# Altium project canbus_module.PrjPcb
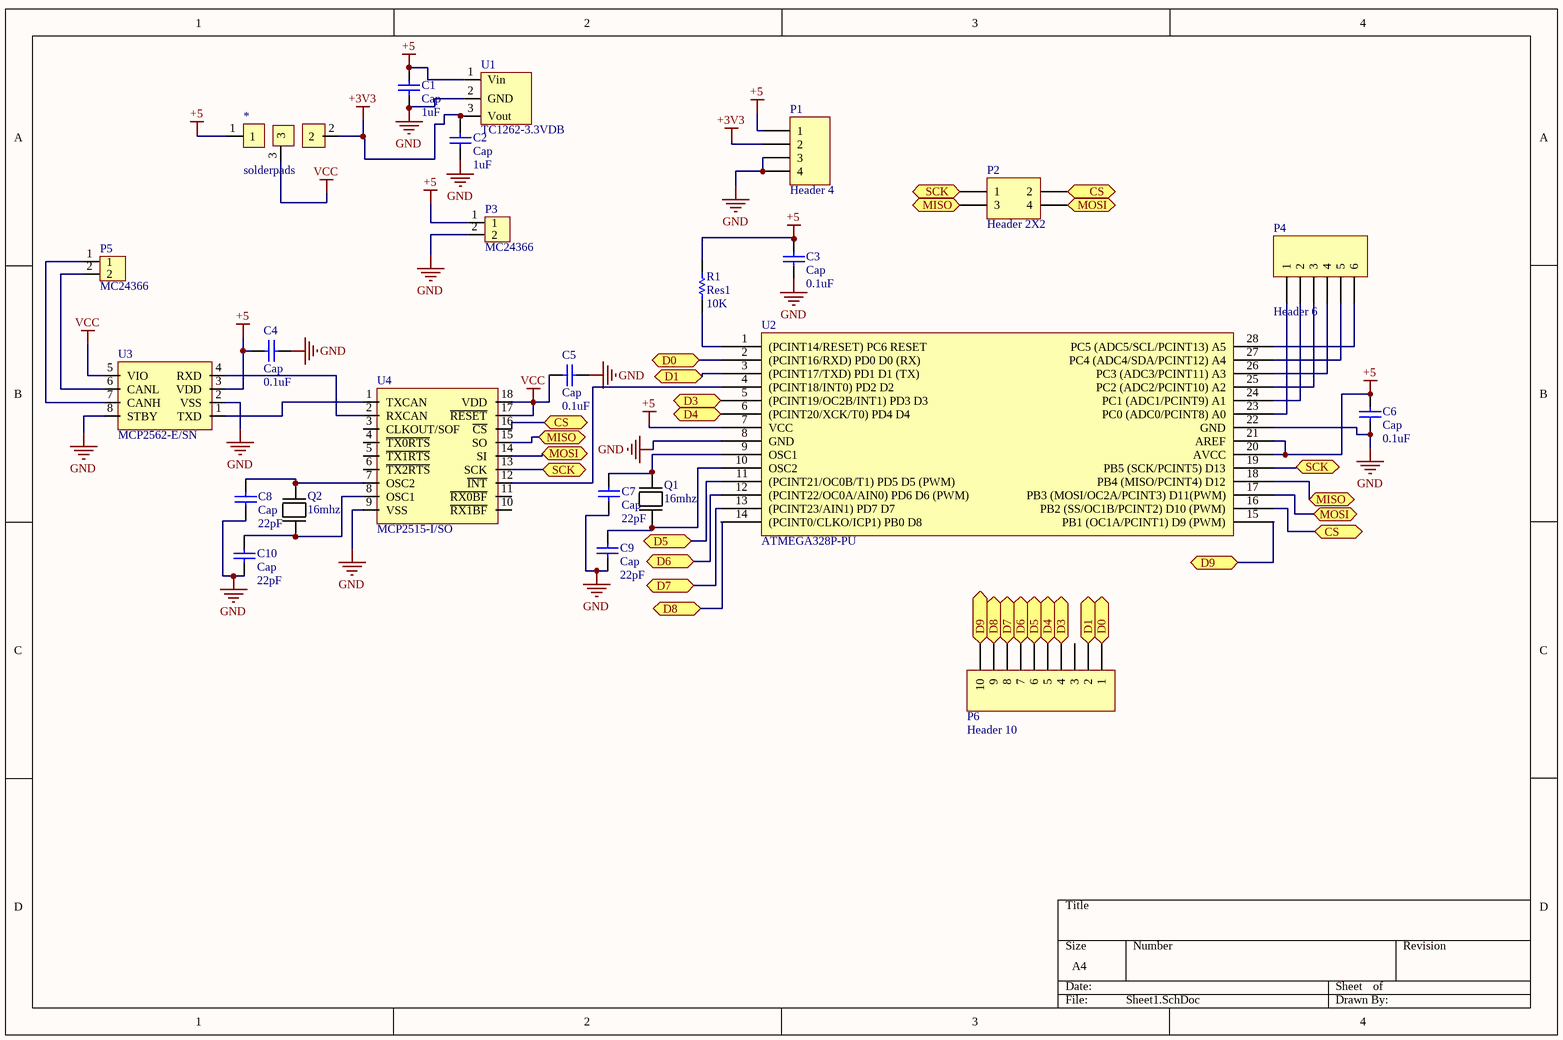
[diagram p0: Sheet1.SchDoc]
1 sheet, 24 parts. Net scope: flat (ports and power ports of the same name join across sheets).
Board file: PCB1.PcbDoc

## Sheet Sheet1.SchDoc
size A4

### Parts
*  solderpads  [solderpads]
C1  Cap  value 1uF  [0603 cap]
C2  Cap  value 1uF  [0603 cap]
C3  Cap  value 0.1uF  [0603 cap]
C4  Cap  value 0.1uF  [0603 cap]
C5  Cap  value 0.1uF  [0603 cap]
C6  Cap  value 0.1uF  [0603 cap]
C7  Cap  value 22pF  [0603 cap]
C8  Cap  value 22pF  [0603 cap]
C9  Cap  value 22pF  [0603 cap]
C10  Cap  value 22pF  [0603 cap]
P1  Header 4  [HDR1X4]
P2  Header 2X2  [HDR2X2]
P3  MC24366  [2pin screw terminal]
P4  Header 6  [HDR1X6]
P5  MC24366  [2pin screw terminal]
P6  Header 10  [HDR1X10]
Q1  16mhz  [DIP HC-49S]
Q2  16mhz  [DIP HC-49S]
R1  Res1  value 10K  [AXIAL-0.3]
U1  TC1262-3.3VDB  [SOT230P700X180-4N]
U2  ATMEGA328P-PU  [DIP28]
U3  MCP2562-E/SN  [SOIC8]
U4  MCP2515-I/SO  [SOIC18]

### Ports
CS, D0, D1, D3, D4, D5, D6, D7, D8, D9, MISO, MOSI, SCK

### Nets
+3V3: *.2 C2.2 P1.2 U1.3(Vout)
+5: *.1 C1.2 C3.2 C4.2 C6.2 P1.1 P3.1 R1.2 U1.1(Vin) U2.7(VCC) U2.20(AVCC) U2.21(AREF) U3.3(VDD)
GND: C1.1 C2.1 C3.1 C4.1 C5.1 C6.1 C7.1 C8.1 C9.1 C10.1 P1.3 P1.4 P3.2 U1.2(GND) U2.8(GND) U2.22(GND) U3.2(VSS) U3.8(STBY) U4.9(VSS)
VCC: *.3 C5.2 U3.5(VIO) U4.17(~{RESET}) U4.18(VDD)
NetC7_2: C7.2 Q1.2 U2.9(OSC1)
NetC8_2: C8.2 Q2.2 U4.7(OSC2)
NetC9_2: C9.2 Q1.1 U2.10(OSC2)
NetC10_2: C10.2 Q2.1 U4.8(OSC1)
NetP2_1: P2.1 U2.19(PB5_(SCK/PCINT5)_D13) U4.13(SCK) ; port SCK
NetP2_2: P2.2 U2.16(PB2_(SS/OC1B/PCINT2)_D10_(PWM)) U4.16(~{CS}) ; port CS
NetP2_3: P2.3 U2.18(PB4_(MISO/PCINT4)_D12) U4.15(SO) ; port MISO
NetP2_4: P2.4 U2.17(PB3_(MOSI/OC2A/PCINT3)_D11(PWM)) U4.14(SI) ; port MOSI
NetP4_1: P4.1 U2.23(PC0_(ADC0/PCINT8)_A0)
NetP4_2: P4.2 U2.24(PC1_(ADC1/PCINT9)_A1)
NetP4_3: P4.3 U2.25(PC2_(ADC2/PCINT10)_A2)
NetP4_4: P4.4 U2.26(PC3_(ADC3/PCINT11)_A3)
NetP4_5: P4.5 U2.27(PC4_(ADC4/SDA/PCINT12)_A4)
NetP4_6: P4.6 U2.28(PC5_(ADC5/SCL/PCINT13)_A5)
NetP5_1: P5.1 U3.7(CANH)
NetP5_2: P5.2 U3.6(CANL)
NetP6_1: P6.1 U2.2((PCINT16/RXD)_PD0_D0_(RX)) ; port D0
NetP6_2: P6.2 U2.3((PCINT17/TXD)_PD1_D1_(TX)) ; port D1
NetP6_4: P6.4 U2.5((PCINT19/OC2B/INT1)_PD3_D3) ; port D3
NetP6_5: P6.5 U2.6((PCINT20/XCK/T0)_PD4_D4) ; port D4
NetP6_6: P6.6 U2.11((PCINT21/OC0B/T1)_PD5_D5_(PWM)) ; port D5
NetP6_7: P6.7 U2.12((PCINT22/OC0A/AIN0)_PD6_D6_(PWM)) ; port D6
NetP6_8: P6.8 U2.13((PCINT23/AIN1)_PD7_D7) ; port D7
NetP6_9: P6.9 U2.14((PCINT0/CLKO/ICP1)_PB0_D8) ; port D8
NetP6_10: P6.10 U2.15(PB1_(OC1A/PCINT1)_D9_(PWM)) ; port D9
NetR1_1: R1.1 U2.1((PCINT14/RESET)_PC6_RESET)
NetU2_4: U2.4((PCINT18/INT0)_PD2_D2) U4.12(~{INT})
NetU3_1: U3.1(TXD) U4.1(TXCAN)
NetU3_4: U3.4(RXD) U4.2(RXCAN)

Not connected (* = marked no-connect by the designer): P6 3; U4 3(CLKOUT/SOF) 4(~{TX0RTS}) 5(~{TX1RTS}) 6(~{TX2RTS}) 10(~{RX1BF}) 11(~{RX0BF})

### Library data of the parts
C1-C10 = Cap: Capacitor; Manufacturer: Walsin Technologies; Manufacturer Part Number: 0603B104K500CT; Capacitance: 100000 pF; Case Style: Ceramic Chip; Product Depth (mm): 0.8 mm; Product Diameter (mm): Not Required mm; Product Length (mm): 1.6 mm; Rad Hardened: No; Temp Coeff (Dielectric): X7R; Tolerance (+ or -): 10%; Voltage: 50VDC; Wire Form: Not Required; Published: 8-Jun-2000; LatestRevisionDate: 17-Jul-2002; LatestRevisionNote: Re-released for DXP Platform.; PackageReference: RAD-0.3; Publisher: Altium Limited; PackageDescription: Radial Cap, Thru-Hole; 2 Leads; 0.3 in Pin Spacing; Supplier 1: Farnell; Stock 1: 3233000; Pricing 1: 4000=0.0042, 20000=0.0028, 40000=0.0022 (EUR); Construction: SMT Chip; Failure Rate: Not Required; Mounting Style: Surface Mount; Operating Temp Range: -55C to 125C; Package / Case: 0603; Packaging: Tape and Reel; Product Height (mm): 0.8 mm; ComponentLink1URL: https://www.verical.com/server-webapp/html/getDatasheet?partID=415741; ComponentLink1Description: https://www.verical.com/server-webapp/html/getDatasheet?partID=415741; ComponentLink2URL: http://www.farnell.com/datasheets/1958513.pdf; ComponentLink2Description: http://www.farnell.com/datasheets/1958513.pdf; ComponentLink3URL: http://components.arrow.com/part/dataview/0323_00656447; ComponentLink3Description: http://components.arrow.com/part/dataview/0323_00656447; Supplier Part Number 1: 2495333
P1 = Header 4: Header, 4-Pin; LatestRevisionDate: 17-Jul-2002; LatestRevisionNote: Re-released for DXP Platform.; Publisher: Altium Limited
P2 = Header 2X2: Header, 2-Pin, Dual row; LatestRevisionDate: 17-Jul-2002; LatestRevisionNote: Re-released for DXP Platform.; Publisher: Altium Limited
P3 P5 = MC24366: TERMINAL BLOCK EUROSTYLE, 2POS, 26-12AWG; Manufacturer: Multicomp; No. of Positions: 2Ways; Rated Voltage: 300V; Rated Current: 16A; Wire Size AWG Min: 26AWG; Wire Size AWG Max: 12AWG; Pitch Spacing: 5.08mm; Wire Connection Method: Screw; Block Orientation: Through Hole Right Angle; SVHC: No SVHC (15-Jun-2015); Supplier 1: Farnell; Manufacturer Part Number: MC24366; Stock 1: 9112; Pricing 1: 1=0.319, 5=0.288, 25=0.257, 50=0.226, 100=0.195, 250=0.165 (EUR); Series: MB310-508M; ComponentLink1URL: https://datasheet.ciiva.com/23597/ta-987-23597041.pdf; ComponentLink1Description: https://datasheet.ciiva.com/23597/ta-987-23597041.pdf; ComponentLink2URL: https://datasheet.ciiva.com/5717/ta-987-5717047.pdf; ComponentLink2Description: https://datasheet.ciiva.com/5717/ta-987-5717047.pdf; Supplier Part Number 1: 2396251
P4 = Header 6: Header, 6-Pin; LatestRevisionDate: 17-Jul-2002; LatestRevisionNote: Re-released for DXP Platform.; Publisher: Altium Limited
P6 = Header 10: Header, 10-Pin; LatestRevisionDate: 17-Jul-2002; LatestRevisionNote: Re-released for DXP Platform.; Publisher: Altium Limited
Q1 Q2 = 9B-16.000MAAJ-B: 16MHz ±30ppm Crystal 18pF 30 Ohm -20°C ~ 70°C  Through Hole HC49/US; Manufacturer: TXC; Catalog Drawings: 9B Series Side 1 / 9B Series Side 2 / 9B Series Bottom / 9B Series Top; Type: MHz Crystal; ESR (Equivalent Series Resistance): 30 Ohm; Operating Mode: Fundamental; Dynamic Catalog: 9B Series; Other Names: 887-1019; Supplier 1: Farnell; Manufacturer Part Number: 9B-16.000MAAJ-B; Stock 1: 9009; Pricing 1: 1=0.436, 50=0.303, 100=0.252, 250=0.248, 500=0.235, 1000=0.186, 5000=0.179, 10000=0.175 (EUR); Standard Package: 1,000; Category: Crystals and Oscillators; Family: Crystals; Series: 9B; Frequency: 16MHz; Frequency Stability: ±30ppm; Frequency Tolerance: ±30ppm; Load Capacitance: 18pF; Operating Temperature: -20°C ~ 70°C; Mounting Type: Through Hole; Package / Case: HC49/US; Size / Dimension: 0.453" L x 0.197" W (11.50mm x 5.00mm); Height: 0.145" (3.68mm); Packaging: Bulk; ComponentLink1URL: https://datasheet.ciiva.com/855/9b-855214.pdf; ComponentLink1Description: https://datasheet.ciiva.com/855/9b-855214.pdf; ComponentLink2URL: https://datasheet.ciiva.com/1356/number-crystal-basic-1356749.pdf; ComponentLink2Description: https://datasheet.ciiva.com/1356/number-crystal-basic-1356749.pdf; ComponentLink3URL: https://datasheet.ciiva.com/26833/getdatasheetpartid-743113-26833255.pdf; ComponentLink3Description: https://datasheet.ciiva.com/26833/getdatasheetpartid-743113-26833255.pdf; Supplier Part Number 1: 1842216
R1 = Res1: Resistor; Published: 8-Jun-2000; LatestRevisionDate: 17-Jul-2002; LatestRevisionNote: Re-released for DXP Platform.; PackageReference: AXIAL-0.3; Publisher: Altium Limited; PackageDescription: Axial Device, Thru-Hole; 2 Leads; 0.3 in Pin Spacing
U2 = ATMEGA328P-PU: ATMEL         ATMEGA328P-PU            8 Bit Microcontroller, Low Power High Performance, ATmega, 20 MHz, 32 KB, 2 KB, 28 Pins, DIP; Manuf. Code: ATM; Clock speed: 20 MHz; Series (embedded microcontroller): AVR® ATmega; Core size: 8-Bit; Processor core: AVR; Oscillator type: Internal; Peripherals: Brown-out Detect/Reset, POR, PWM, WDT; I/O number: 23; Program memory type: FLASH; Supply voltage (max.): 5.5 V; Supply voltage (min.): 1.8 V; Data converter (embedded microcontroller): A/D 6x10b; EEPROM size: 1 K x 8; Connectivity: I²C, SPI, UART/USART; Program memory size: 32 KB (16 K x 16); RAM size: 2 K x 8; Casing: PDIP 28; Supplier 1: Farnell; Manufacturer: Atmel; Manufacturer Part Number: ATMEGA328P-PU; Stock 1: 2066; Pricing 1: 1=3.33, 10=2.98, 25=2.68, 50=2.48, 100=2.35, 250=1.98, 600=1.67, 2000=1.64 (EUR); Type: ATMEGA328P-PU; Max. operating temperature: +85 °C; Operating temperature (min.): -40 °C; ComponentLink1URL: https://datasheet.ciiva.com/19457/2139111-19457070.pdf; ComponentLink1Description: https://datasheet.ciiva.com/19457/2139111-19457070.pdf; ComponentLink2URL: https://datasheet.ciiva.com/20168/73-4283-20168380.pdf; ComponentLink2Description: https://datasheet.ciiva.com/20168/73-4283-20168380.pdf; ComponentLink3URL: https://datasheet.ciiva.com/1157/1684409-1157696.pdf; ComponentLink3Description: https://datasheet.ciiva.com/1157/1684409-1157696.pdf; ComponentLink4URL: https://datasheet.ciiva.com/29119/155197-da-01-en-microcontr-atmega328p-pu-8bit-pdip-28-29119593.pdf; ComponentLink4Description: https://datasheet.ciiva.com/29119/155197-da-01-en-microcontr-atmega328p-pu-8bit-pdip-28-29119593.pdf; ComponentLink5URL: https://datasheet.ciiva.com/26818/atmega328p-pu-26818578.pdf; ComponentLink5Description: https://datasheet.ciiva.com/26818/atmega328p-pu-26818578.pdf; ComponentLink6URL: https://datasheet.ciiva.com/15213/getdatasheetpartid-318533-15213133.pdf; ComponentLink6Description: https://datasheet.ciiva.com/15213/getdatasheetpartid-318533-15213133.pdf; Supplier Part Number 1: 1715487
U3 = MCP2562-E/SN: MICROCHIP         MCP2562-E/SN            CAN Bus, Transceiver, CAN, LIN, 1, 1, 4.5 V, 5.5 V, SOIC; Manufacturer: Microchip Technology; Propagation Delay Time ns: 125 ns; Data Rate: 1 Mbps; Operating Supply Voltage: 1.8 V to 5.5 V; Supply Current: 70 mA; Supply Voltage - Max: 5.5 V; Supply Voltage - Min: 1.8 V; Supplier 1: Farnell; Manufacturer Part Number: MCP2562-E/SN; Stock 1: 10814; Pricing 1: 1=1.12, 10=0.838, 25=0.714, 50=0.674, 100=0.638 (EUR); Product Category: CAN Interface IC; RoHS: Details; Type: CAN Transceiver; Operating Temperature Range: - 40 C to + 125 C; Package / Case: SOIC-8; Packaging: Tube; Brand: Microchip Technology; Maximum Operating Temperature: + 125 C; Minimum Operating Temperature: - 40 C; Mounting Style: SMD/SMT; Propagation Delay Time: 125 ns; Factory Pack Quantity: 100; ComponentLink1URL: https://datasheet.ciiva.com/26922/getdatasheetpartid-776214-26922473.pdf; ComponentLink1Description: https://datasheet.ciiva.com/26922/getdatasheetpartid-776214-26922473.pdf; ComponentLink2URL: https://datasheet.ciiva.com/24192/filehandler-aspxddocname-en561044-24192158.pdf; ComponentLink2Description: https://datasheet.ciiva.com/24192/filehandler-aspxddocname-en561044-24192158.pdf; ComponentLink3URL: https://datasheet.ciiva.com/39123/21125167b-39123503.pdf; ComponentLink3Description: https://datasheet.ciiva.com/39123/21125167b-39123503.pdf; ComponentLink4URL: https://datasheet.ciiva.com/18624/25167b-18624808.pdf; ComponentLink4Description: https://datasheet.ciiva.com/18624/25167b-18624808.pdf; ComponentLink5URL: https://datasheet.ciiva.com/29898/25167b-29898006.pdf; ComponentLink5Description: https://datasheet.ciiva.com/29898/25167b-29898006.pdf; ComponentLink6URL: https://datasheet.ciiva.com/22747/1755821-22747911.pdf; ComponentLink6Description: https://datasheet.ciiva.com/22747/1755821-22747911.pdf; ComponentLink7URL: https://datasheet.ciiva.com/48512/mcp2562-eng-tds-48512071.pdf; ComponentLink7Description: https://datasheet.ciiva.com/48512/mcp2562-eng-tds-48512071.pdf; Supplier Part Number 1: 2362839
U4 = MCP2515-I/SO: MICROCHIP         MCP2515-I/SO             CAN Bus, Controller, SPI, 3, 2, 2.7 V, 5.5 V, SOIC; Manufacturer: Microchip Technology; No. of TX Buffers: 3; No. of RX Buffers: 2; Supply Voltage Min: 2.7V; Supply Voltage Max: 5.5V; No. of Pins: 18Pins; Supplier 1: Farnell; Manufacturer Part Number: MCP2515-I/SO; Stock 1: 8767; Pricing 1: 1=1.83, 10=1.55, 25=1.46, 50=1.36, 100=1.29 (EUR); IC Interface Type: SPI; Interface Case Style: SOIC; Operating Temperature Min: -40°C; Operating Temperature Max: 85°C; Packaging: Each; Product Range: -; Automotive Qualification Standard: -; ComponentLink1URL: https://datasheet.ciiva.com/14152/ea644222-e-14152533.pdf; ComponentLink1Description: https://datasheet.ciiva.com/14152/ea644222-e-14152533.pdf; ComponentLink2URL: https://datasheet.ciiva.com/18405/70045398-18405546.pdf; ComponentLink2Description: https://datasheet.ciiva.com/18405/70045398-18405546.pdf; ComponentLink3URL: https://datasheet.ciiva.com/1495/1669372-1495083.pdf; ComponentLink3Description: https://datasheet.ciiva.com/1495/1669372-1495083.pdf; ComponentLink4URL: https://datasheet.ciiva.com/1695/21801g-1695405.pdf; ComponentLink4Description: https://datasheet.ciiva.com/1695/21801g-1695405.pdf; ComponentLink5URL: https://datasheet.ciiva.com/15150/getdatasheetpartid-446809-15150054.pdf; ComponentLink5Description: https://datasheet.ciiva.com/15150/getdatasheetpartid-446809-15150054.pdf; ComponentLink6URL: https://datasheet.ciiva.com/16205/filehandler-aspxddocname-en011733-16205222.pdf; ComponentLink6Description: https://datasheet.ciiva.com/16205/filehandler-aspxddocname-en011733-16205222.pdf; ComponentLink7URL: https://datasheet.ciiva.com/29305/651448-da-01-en-ic-can-cont-mcp2515-i-so-soic-18-mcp-29305158.pdf; ComponentLink7Description: https://datasheet.ciiva.com/29305/651448-da-01-en-ic-can-cont-mcp2515-i-so-soic-18-mcp-29305158.pdf; Supplier Part Number 1: 1292239